# Altium schematic sheet 230C_3V3_PSU_TPS40200.SchDoc: Communications
size Tabloid; CompanyName: Vertex; Organization: Vertex Downhole Ltd.; Address1: 7004 5 St SE Unit C; Address2: Calgary, AB; Address3: T2H 2G3; Address4: Canada; DocumentNumber: 550014; Revision: 4.1; SheetNumber: 6; SheetTotal: 8; Operating Temperature Range: -55°C ~ 230°C
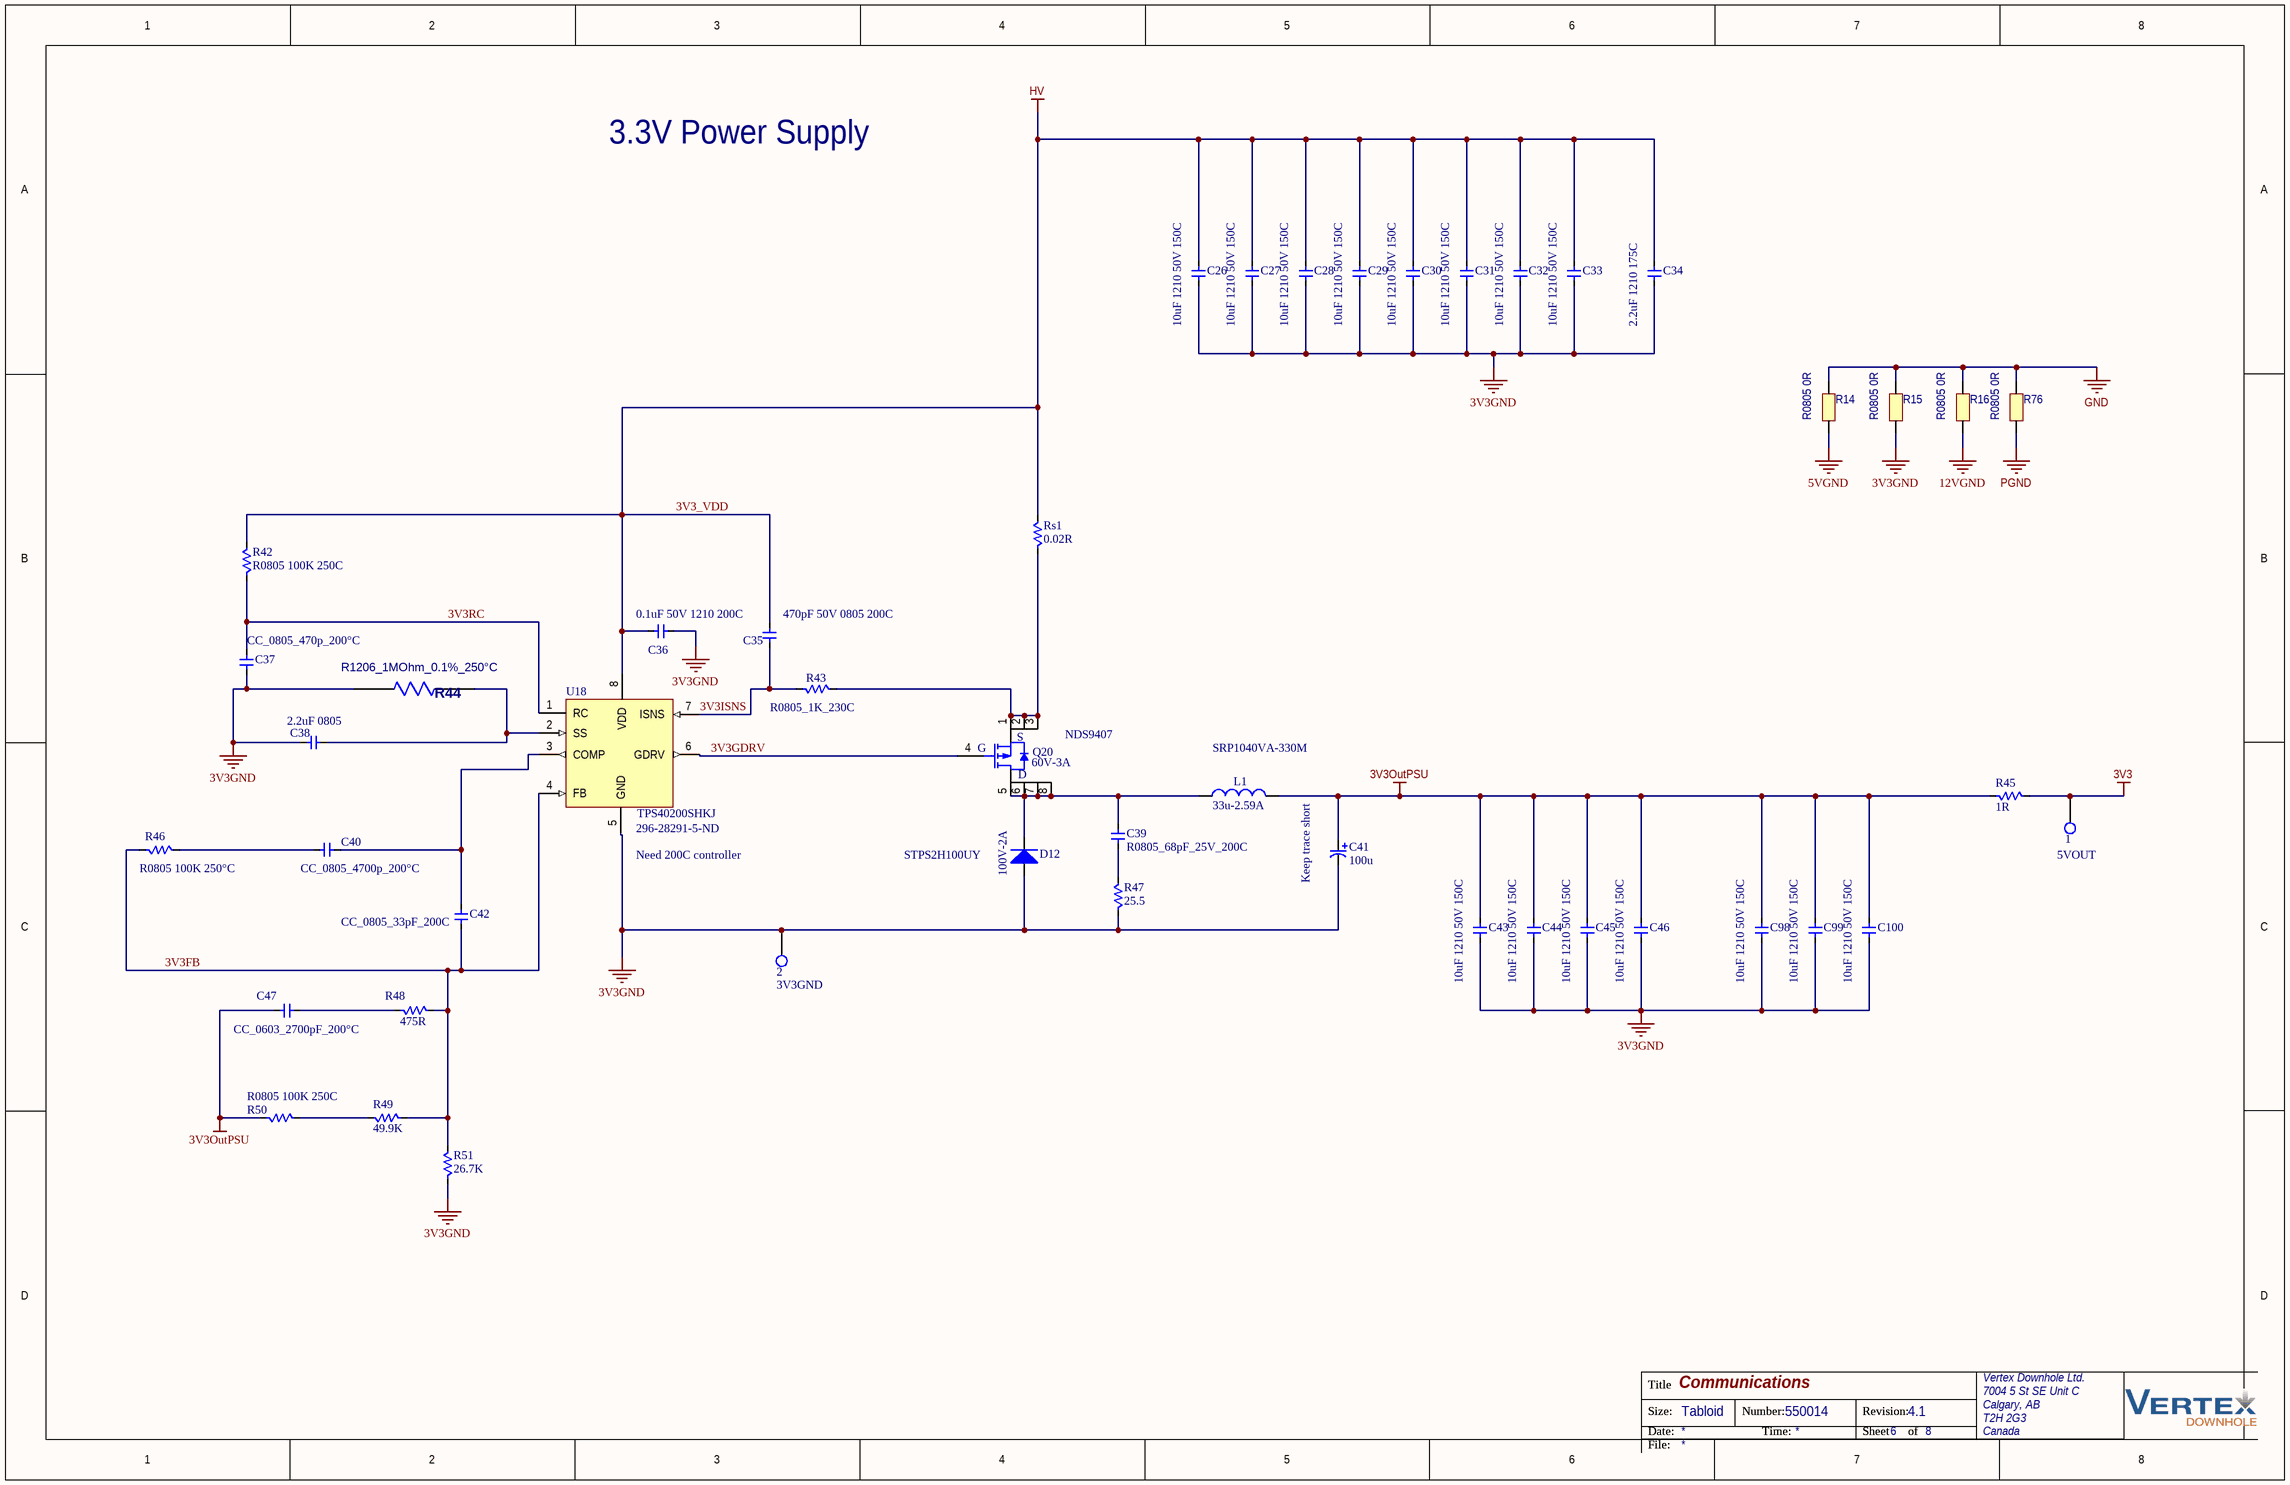
[diagram p0: 230C_3V3_PSU_TPS40200.SchDoc]

## Parts
1  5VOUT  [TP-S]  (no BOM)
2  3V3GND  [TP-S]  (no BOM)
C26  value 10uF 1210 50V 150C  [1210]  (hidden comment: GCM32EL8EH106KA07K)
C27  value 10uF 1210 50V 150C  [1210]  (hidden comment: GCM32EL8EH106KA07K)
C28  value 10uF 1210 50V 150C  [1210]  (hidden comment: GCM32EL8EH106KA07K)
C29  value 10uF 1210 50V 150C  [1210]  (hidden comment: GCM32EL8EH106KA07K)
C30  value 10uF 1210 50V 150C  [1210]  (hidden comment: GCM32EL8EH106KA07K)
C31  value 10uF 1210 50V 150C  [1210]  (hidden comment: GCM32EL8EH106KA07K)
C32  value 10uF 1210 50V 150C  [1210]  (hidden comment: GCM32EL8EH106KA07K)
C33  value 10uF 1210 50V 150C  [1210]  (hidden comment: GCM32EL8EH106KA07K)
C34  value 2.2uF 1210 175C  [1210]  (hidden comment: C1206H104J3GACTU)
C35  value 470pF 50V 0805 200C  [1210]  (hidden comment: C1206H104J3GACTU)
C36  value 0.1uF 50V 1210 200C  [0805]  (hidden comment: 0805D121J251KHT)
C37  value CC_0805_470p_200°C  [0805]  (hidden comment: C0805H471J1GACTU)
C38  value 2.2uF 0805  [0805]  (hidden comment: C0805C272K5HACTU)
C39  value R0805_68pF_25V_200C  [0805]  (hidden comment: C0805H680J3GACTU)
C40  value CC_0805_4700p_200°C  [0805]  (hidden comment: C0805H472J1GACT500)
C41  value 100u  [0805]  (hidden comment: 0805D121J251KHT)
C42  value CC_0805_33pF_200C  [1210]  (hidden comment: C1206H104J3GACTU)
C43  value 10uF 1210 50V 150C  [1210]  (hidden comment: GCM32EL8EH106KA07K)
C44  value 10uF 1210 50V 150C  [1210]  (hidden comment: GCM32EL8EH106KA07K)
C45  value 10uF 1210 50V 150C  [1210]  (hidden comment: GCM32EL8EH106KA07K)
C46  value 10uF 1210 50V 150C  [1210]  (hidden comment: GCM32EL8EH106KA07K)
C47  value CC_0603_2700pF_200°C  [0603]  (hidden comment: C1206H104J3GACTU)
C98  value 10uF 1210 50V 150C  [1210]  (hidden comment: GCM32EL8EH106KA07K)
C99  value 10uF 1210 50V 150C  [1210]  (hidden comment: GCM32EL8EH106KA07K)
C100  value 10uF 1210 50V 150C  [1210]  (hidden comment: GCM32EL8EH106KA07K)
D12  value 100V-2A  [SMB]  (hidden comment: STPS2H100UY)
L1  value 33u-2.59A  [IND_CB_DRA125]  (hidden comment: DRA125-470-R)
Q20  value 60V-3A  [SOIC_S9407_ONS]  (hidden comment: NDS9407)
R14  R0805 0R  [0805-CR]
R15  R0805 0R  [0805-CR]
R16  R0805 0R  [0805-CR]
R42  value R0805 100K 250C  [0805]  (hidden comment: PATT0805E1003BGT1)
R43  value R0805_1K_230C  [0805]  (hidden comment: ERJ-PB6B6812V)
R44  R1206_1MOhm_0.1%_250°C  [1206]
R45  value 1R  [0805]  (hidden comment: RS73F2ATTD1501B)
R46  value R0805 100K 250°C  [0805]  (hidden comment: PATT0805E1003BGT1)
R47  value 25.5  [0805]  (hidden comment: ERJ-PB6B1004V)
R48  value 475R  [0805]  (hidden comment: ERJ-PB6B6812V)
R49  value 49.9K  [0805]  (hidden comment: PATT0603E49R9BGT1)
R50  value R0805 100K 250C  [0805]  (hidden comment: PATT0805E1003BGT1)
R51  value 26.7K  [0805]  (hidden comment: RNCP0805FTD1R00)
R76  R0805 0R  [0805-CR]
Rs1  value 0.02R  [1206]  (hidden comment: ERJ-8CWFR020V)
U18  Supplier Part Number 1: 296-28291-5-ND  [SOIC_S9407_ONS]  (hidden comment: TPS40200SHKJ)

## Nets
3V3: 1.1 R45.2
3V3_VDD: C26.2 C27.2 C28.2 C29.2 C30.2 C31.2 C32.2 C33.2 C34.2 C35.1 C36.1 R42.2 Rs1.2 U18.8(VDD)  [also labelled HV]
3V3GND: 2.1 C26.1 C27.1 C28.1 C29.1 C30.1 C31.1 C32.1 C33.1 C34.1 C36.2 C37.1 C38.1 C41.2 C43.1 C44.1 C45.1 C46.1 C98.1 C99.1 C100.1 D12.A R15.1 R44.1(A) R47.1 R51.1 U18.5(GND)
3V3OutPSU: C41.1 C43.2 C44.2 C45.2 C46.2 C47.1 C98.2 C99.2 C100.2 L1.2 R45.1 R50.1
5VGND: R14.1
12VGND: R16.1
GND: R14.2 R15.2 R16.2 R76.2
PGND: R76.1
3V3FB: C42.1 R46.1 R48.2 R49.1 R51.2 U18.4(FB)
3V3GDRV: Q20.4(G) U18.6(GDRV)
3V3ISNS: C35.2 R43.1 U18.7(ISNS)
3V3RC: C37.2 R42.1 U18.1(RC)
NetC38_2: C38.2 R44.2(B) U18.2(SS)
NetC39_1: C39.1 R47.2
NetC39_2: C39.2 D12.K L1.1 Q20.5(D) Q20.6(D) Q20.7(D) Q20.8(D)
NetC40_1: C40.1 R46.2
NetC40_2: C40.2 C42.2 U18.3(COMP)
NetC47_2: C47.2 R48.1
NetQ20_1: Q20.1(S) Q20.2(S) Q20.3(S) R43.2 Rs1.1
NetR49_2: R49.2 R50.2

## Notes on the sheet
- 3.3V Power Supply
- (near Q20) NDS9407
- (near L1) SRP1040VA-330M
- (near U18) Need 200C controller
- STPS2H100UY
- Keep trace short
- Title
- Size:
- Date:
- Tabloid
- Number:
- Time:
- Revision:
- Sheet
- of
- File:

## Library data of the parts
1 2 = TP: Test  Point; Number: PMT104887; Subtype: Test Loop; Num Connections: 1; RoHS: 0; Package: Through hole
C26 C43 = CC-1210: CAP CER 0.1UF 50V C0G/NP0 1210 200C; Tolerance: ±10%; Temp. Coeff.: X8L; Mfg: Murata Electronics; Vendor: Digi-Key; VendorPN: 490-GCM32EL8EH106KA07KCT-ND; Do not load: 0; Class: Epart; CES#: *; Voltage: 50V; Temperature: -55°C ~ 150°C; Height: 1.6mm; MfgPN: GCM32EL8EH106KA07K; Unit Price: 19.5; Notes: *; Package: CC-1210; Dimension: 3.20mm x 1.60mm; #1Mfg: *; #1MfgPN: *; Temperature Tested: *
C27-C33 C44-C46 C98-C100 = CC-1210: CAP CER 0.1UF 50V C0G/NP0 1210 200C; Tolerance: ±5%; Temp. Coeff.: X8L; Mfg: Murata Electronics; Vendor: Digi-Key; VendorPN: 490-GCM32EL8EH106KA07KCT-ND; Do not load: 0; Class: Epart; CES#: *; Voltage: 50V; Temperature: -55°C ~ 200°C; Height: 1.6mm; MfgPN: GCM32EL8EH106KA07K; Unit Price: 19.5; Notes: *; Package: CC-1210; Dimension: 3.20mm x 1.60mm; #1Mfg: *; #1MfgPN: *; Temperature Tested: *
C34 = CC-1210: CAP CER 0.1UF 50V C0G/NP0 1210 200C; Voltage: 25V; Tolerance: ±5%; Temp. Coeff.: C0G, NP0; Mfg: KEMET; Vendor: Digi-Key; VendorPN: 399-5750; Do not load: 0; Class: Epart; CES#: *; Temperature: -55°C ~ 200°C; Height: 1.6mm; MfgPN: C1206H104J3GACTU; Unit Price: 19.5; Notes: *; Package: CC-1206; Dimension: 3.20mm x 1.60mm; #1Mfg: *; #1MfgPN: *; Temperature Tested: *
C35 = CC-0805-100p-100V-10%-200C-NP0: CAP CER 470PF 50V C0G/NP0 0805 200C; Voltage: 100V; Tolerance: ±5%; Temp. Coeff.: C0G, NP0; Mfg: Vishay Vitramont; MfgPN: VJ0805D471JXAQJHT; Vendor: Digi-Key; VendorPN: 720-VJ0805D471JXAQJHTCT-ND; Do not load: 0; Class: Epart; Temperature: -55°C ~ 200°C; Height: 1.37mm; Unit Price: 0.34; Notes: *; Package: CC-0805; Dimension: 1.60mm x 0.80mm; #1Mfg: *; #1MfgPN: *; Temperature Tested: *
C36 = CC-1210: CAP CER 0.1UF 50V C0G/NP0 1210 200C; Voltage: 25V; Tolerance: ±5%; Temp. Coeff.: C0G, NP0; Mfg: KEMET; MfgPN: C1206H104J3GACTU; Vendor: Digi-Key; VendorPN: 399-5750; Do not load: 0; Class: Epart; CES#: *; Temperature: -55°C ~ 200°C; Height: 1.6mm; Unit Price: 19.5; Notes: *; Package: CC-1206; Dimension: 3.20mm x 1.60mm; #1Mfg: *; #1MfgPN: *; Temperature Tested: *
C37 = CC-0805-470p-100V-10%-150C-NP0: CAPACITOR CER 470PF 100V C0G/NP0 0805; Tolerance: ±10%; Temp. Coeff.: C0G, NP0; Mfg: KEMET; Vendor: Digi-Key; VendorPN: 720-1262; Do not load: 0; Class: Epart; CES#: *; Voltage: 100V; Temperature: -55°C ~ 200°C; Height: 1.25mm; MfgPN: C0805H471J1GACTU; Unit Price: 0.47; Notes: *; Package: CC-0805; Dimension: 2.00mm x 1.25mm; #1Mfg: *; #1MfgPN: *; Temperature Tested: *
C38 = CC-0805-47n-25V-5%-125C-NP0: CAPACITOR CER 0.047UF 25V C0G/NP0 0805; Tolerance: ±5%; Temp. Coeff.: C0G, NP0; Mfg: KEMET; MfgPN: C0805C473J3GACAUTO; Vendor: Digi-Key; VendorPN: 399-6970; Do not load: 0; Class: Epart; CES#: *; Voltage: 25V; Temperature: -55°C ~ 125°C; Height: 1.25mm; Unit Price: 0.95; Notes: *; Package: CC-0805; Dimension: 2.00mm x 1.25mm; #1Mfg: *; #1MfgPN: *; Temperature Tested: *
C39 = CC-0805-2200p-100V-5%-200C-NP0: CAPACITOR CER 2200PF 100V C0G/NP0 0805; Tolerance: ±5%; Temp. Coeff.: C0G, NP0; Mfg: KEMET; Vendor: Mouser; VendorPN: 80-C0805H680J3G; Do not load: 0; Class: Epart; Voltage: 100V; Temperature: -55°C ~ 200°C; Height: 0.9mm; MfgPN: C0805H680J3GACTU; Unit Price: 2.65; Notes: *; Package: CC-0805; Dimension: 2.00mm x 1.25mm; #1Mfg: *; #1MfgPN: *; Temperature Tested: *; Supplier 1: Digi-Key
C40 = CC-0805-2200p-100V-5%-200C-NP0: CAPACITOR CER 2200PF 100V C0G/NP0 0805; Tolerance: ±5%; Temp. Coeff.: C0G, NP0; Mfg: KEMET; Vendor: Digi-Key; VendorPN: 399-9996-2-ND; Do not load: 0; Class: Epart; Voltage: 100V; Temperature: -55°C ~ 200°C; Height: 0.9mm; MfgPN: C0805H472J1GACT500; Unit Price: 2.65; Notes: *; Package: CC-0805; Dimension: 2.00mm x 1.25mm; #1Mfg: *; #1MfgPN: *; Temperature Tested: *; Supplier 1: Digi-Key
C41 = CT-2917-100u-16V-10%-150C: CAPACITOR TANT 100UF 16V 10% 2917; Mfg: KEMET; MfgPN: T498X107K016ATE075; Vendor: Digi-Key; VendorPN: 399-5207; Do not load: 0; Class: Epart; CES#: *; Voltage: 16V; Tolerance: ±10%; Temperature: -55°C ~ 150°C; Height: 4.1mm; Unit Price: 6.63; Notes: *; Package: CT-2917; Dimension: 7.30mm x 4.30mm; #1Mfg: *; #1MfgPN: *; Temperature Tested: *
C42 = CC-0805-120p-100V-5%-200C-NP0: CAPACITOR CER 120PF 250V NP0 0805; Tolerance: ±5%; Temp. Coeff.: C0G, NP0; Mfg: Knowles Novacap; MfgPN: 0805D121J251KHT; Vendor: Digi-Key; Do not load: 0; Class: Epart; Voltage: 250V; Temperature: -55°C ~ 200°C; Height: 1.37mm; VendorPN: 0805D121J251KHT; Unit Price: 0.25; Notes: *; Package: CC-0805; Dimension: 2.03mm x 1.27mm; #1Mfg: *; #1MfgPN: *; Temperature Tested: *
C47 = CC-0805-2700p-50V-10%-150C: CAPACITOR CER 2700PF 50V X8R 0805; Tolerance: ±5%; Temp. Coeff.: C0G; Mfg: KEMET; MfgPN: C0603H272J5GACTU; Vendor: Digi-Key; VendorPN: 399-C0603H272J5GACTUCT-ND; Do not load: 0; Class: Epart; CES#: *; Voltage: 50V; Temperature: -55°C ~ 200°C; Height: 1.25mm; Unit Price: 0.84; Notes: *; Package: CC-0805; Dimension: 2.00mm x 1.25mm; #1Mfg: *; #1MfgPN: *; Temperature Tested: *
D12 = DS-SMB-100V-2A: DIODE SCHOTTKY 100V 2A SMB; Mfg: STMicroelectronics; Vendor: Digi-Key; VendorPN: 497-11093; Do not load: 0; Class: Epart; CES#: *; Temperature: -40°C ~ 175°C; Voltage: 100V; Height: 1.9 mm; MfgPN: STPS2H100UY; Unit Price: 0.81; Notes: *; Current: 2A; Package: SMB; Dimension: 3.5 X 2.8 X 1.9 mm; #1Mfg: *; #1MfgPN: *; Temperature Tested: *
L1 = LL-12.5X12.5-47u-2.59A: INDUCTOR 47UH 2.59A 81 MOHM; DC Resistance (DCR): 81 mOhm; Mfg: Eaton; Vendor: Digi-Key; VendorPN: 283-3577; Do not Load: 0; Tolerance: ±20%; Class: Epart; CES#: *; Temperature: -40°C ~ 165°C; Height: 6 mm; MfgPN: DRA125-470-R; Unit Price: 4.36; Current: 2.59A; Package: LL-12.5X12.5; Dimension: 12.50mm x 12.50mm; #2Mfg: *; #2MfgPN: *; Temperature Tested: *
Q20 = QF-SOIC8-PCH-60V-3A: MOSFET P-CH 60V 3A 8-SOIC; Mfg: ON Semiconductor; Vendor: Digi-Key; Do not Load: 0; Power: 2.5W (Ta); Rds On: 150 mOhm @ 3A, 10V; Class: Epart; Temperature: -55°C ~ 175°C (TJ); Voltage: 60V; Height: 1.7 mm; MfgPN: NDS9407; VendorPN: NDS9407; Unit price: 1.55; Package: SOIC8; Dimension: 6.2 X 5.0 X 1.7 mm; Current: 3A; #2Mfg: *; #2MfgPN: *; Temperature Tested: *
R14-R16 R76 = RES: Resistor; Manufacturer: Yageo; Vendor PN: 311-10.0KCRCT-ND; Vendor: Digi-Key; Manu PN: RC0805FR-0710KL; Vertex PN: 6181002
R42 R46 R50 = RS-0805-9.1K-0.1%-1/4W-155C: 100 kOhms ±0.1% 0.2W, 1/5W Chip Resistor 0805 (2012 Metric); Temp. Coeff.: ±25ppm/°C; Mfg: Vishay Dale Thin Film; Vendor: Digi-Key; VendorPN: 764-1065-1-ND; Do not load: 0; Power: 0.25W; Class: Epart; Tolerance: ±0.1%; Temperature: -55°C ~ 250°C; Height: 0.46 mm; MfgPN: PATT0805E1003BGT1; Unit Price: 0.55; Notes: *; Package: RS-0805; Dimension: 1.60mm x 0.80mm; #2Mfg: *; #2MfgPN: *; Temperature Tested: *
R43 = RS-0805-1K-0.1%-1/8W-155C: RESISTOR SMD 1K OHM 0.1% 1/8W 0805; Tolerance: ±1%; Temp. Coeff.: ±25ppm/°C; Mfg: Vishay / Sfernice; MfgPN: CHPHT0805K1001FGT; Vendor: Mouser; VendorPN: 71-CHPHT0805K1001FGT; Do not load: 0; Power: 0.125W; Class: Epart; CES#: *; Temperature: -55°C ~ 230°C; Height: 0.7 mm; Notes: *; Package: RS-0805; Dimension: 2.00mm x 1.25mm; #2Mfg: *; #2MfgPN: *; Temperature Tested: *
R44 = RC_1206: 1206; Part Field 1: Description Resistor in 1206 package; MPN: PATT1206E1004BGT1; Mfr: Vishay Dale Thin Film
R45 = RS-0805-1R-1%-0.25W-155C: RESISTOR SMD 1 OHM 1% 1/4W 0805; Temp. Coeff.: ±100ppm/°C; Mfg: Stackpole Electronics Inc.; MfgPN: RNCP0805FTD1R00; Vendor: Digi-Key; Do not load: 0; Power: 0.25W; Class: Epart; CES#: *; Tolerance: ±1%; Temperature: -55°C ~ 155°C; Height: 0.7 mm; VendorPN: RNCP0805FTD1R00; Unit Price: 0.15; Notes: *; Package: RS-0805; Dimension: 2.00mm x 1.25mm; #2Mfg: *; #2MfgPN: *; Temperature Tested: *
R47 = RS-0805-10.2K-0.1%-0.25W-155C: RESISTOR SMD 10.2K OHM 1% 1/4W 0805; Temp. Coeff.: ±50ppm/°C; Mfg: Panasonic Electronic Components; MfgPN: ERJ-PB6B1022V; Vendor: Digi-Key; VendorPN: P20709TR-ND; Do not load: 0; Power: 0.25W; Class: Epart; Tolerance: ±1%; Temperature: -55°C ~ 155°C; Height: 0.7 mm; Unit Price: 0.55; Notes: *; Package: RS-0805; Dimension: 2.00mm x 1.25mm; #2Mfg: *; #2MfgPN: *; Temperature Tested: *
R48 = RS-0805-475R-0.1%-0.25W-155C: RESISTOR SMD 475 OHM 0.1% 1/10W 0805; Temp. Coeff.: ±50ppm/°C; Mfg: Panasonic Electronic Components; MfgPN: ERJ-PB6B4750V; Vendor: Digi-Key; VendorPN: P20557; Do not load: 0; Power: 0.25W; Class: Epart; Tolerance: ±0.1%; Temperature: -55°C ~ 155°C; Height: 0.7 mm; Unit Price: 0.55; Notes: *; Package: RS-0805; Dimension: 2.00mm x 1.25mm; #2Mfg: *; #2MfgPN: *; Temperature Tested: *
R49 = RS-0805-1.5K-0.1%-1/4W-155C: 49.9 Ohms ±0.1% 0.15W Chip Resistor 0603 (1608 Metric) Anti-Sulfur, Automotive AEC-Q200, Moisture Resistant Thin Film; Temp. Coeff.: ±25ppm/°C; Mfg: Vishay Dale Thin Film; Vendor: Digi-Key; VendorPN: 764-1019-1-ND; Do not load: 0; Power: 0.250W; Class: Epart; CES#: *; Tolerance: ±0.1%; Temperature: -55°C ~ 255°C; Height: 0.46 mm; MfgPN: PATT0603E49R9BGT1; Notes: *; Package: RS-0805; Dimension: 2.00mm x 1.25mm; #2Mfg: *; #2MfgPN: *; Temperature Tested: *
R51 = RS-0805-49.9R-0.25%-0.25W-155C: RESISTOR SMD 49.9 OHM 0.1% 1/25W 0805; Temp. Coeff.: ±25ppm/°C; Mfg: KOA Speer Electronics, Inc.; MfgPN: RS73G2ATTD49R9C; Vendor: Digi-Key; VendorPN: 2019-RS73G2ATTD49R9CTR-ND; Do not load: 0; Power: 0.25W; Class: Epart; Tolerance: ±0.1%; Temperature: -55°C ~ 155°C; Height: 0.5 mm; Unit Price: 0.113; Notes: *; Package: RS-0603; Dimension: 1.60mm x 0.80mm; #2Mfg: *; #2MfgPN: *; Temperature Tested: *
Rs1 = RS-1206-0.02R-1%-1W-155C: RESISTOR SMD 0.02 OHM 1% 1W 1206; Temp. Coeff.: ±75ppm/°C; Mfg: Panasonic Electronic Components; Vendor: Digi-Key; VendorPN: P0.02BV; Do not load: 0; Class: Epart; CES#: *; Tolerance: ±1%; Temperature: -55°C ~ 155°C; Height: 0.6; MfgPN: ERJ-8CWFR020V; Unit Price: 1.04; Notes: *; Power: 1W; Package: RS-1206; Dimension: 1.60mm x 3.20mm; #2Mfg: *; #2MfgPN: *; Temperature Tested: *
U18 = UP-SREG-CFP8-Buck-ADJ-TPS40200: IC REG CTRLR BUCK 8CFP; Mfg: Texas Instruments; Vendor: Digi-Key; VendorPN: 296-28291; Do not load: 0; Voltage Output: Adjustive; Voltage Input: 5.5 V ~ 52 V; Class: Epart; Topology: Buck; Temperature: -55°C ~ 210°C (TA); Height: 2.0 mm; MfgPN: TPS40200SHKJ; Unit Price: 140.54; Notes: *; Package: CFP-8; Dimension: 24.7 X 7.3 X 2.0; #2Mfg: *; #2MfgPN: *; Temperature Tested: *; Value: TPS40200SHKJ; Supplier 1: Digi-Key